# Altium schematic sheet 12V Regulator.SchDoc
size A
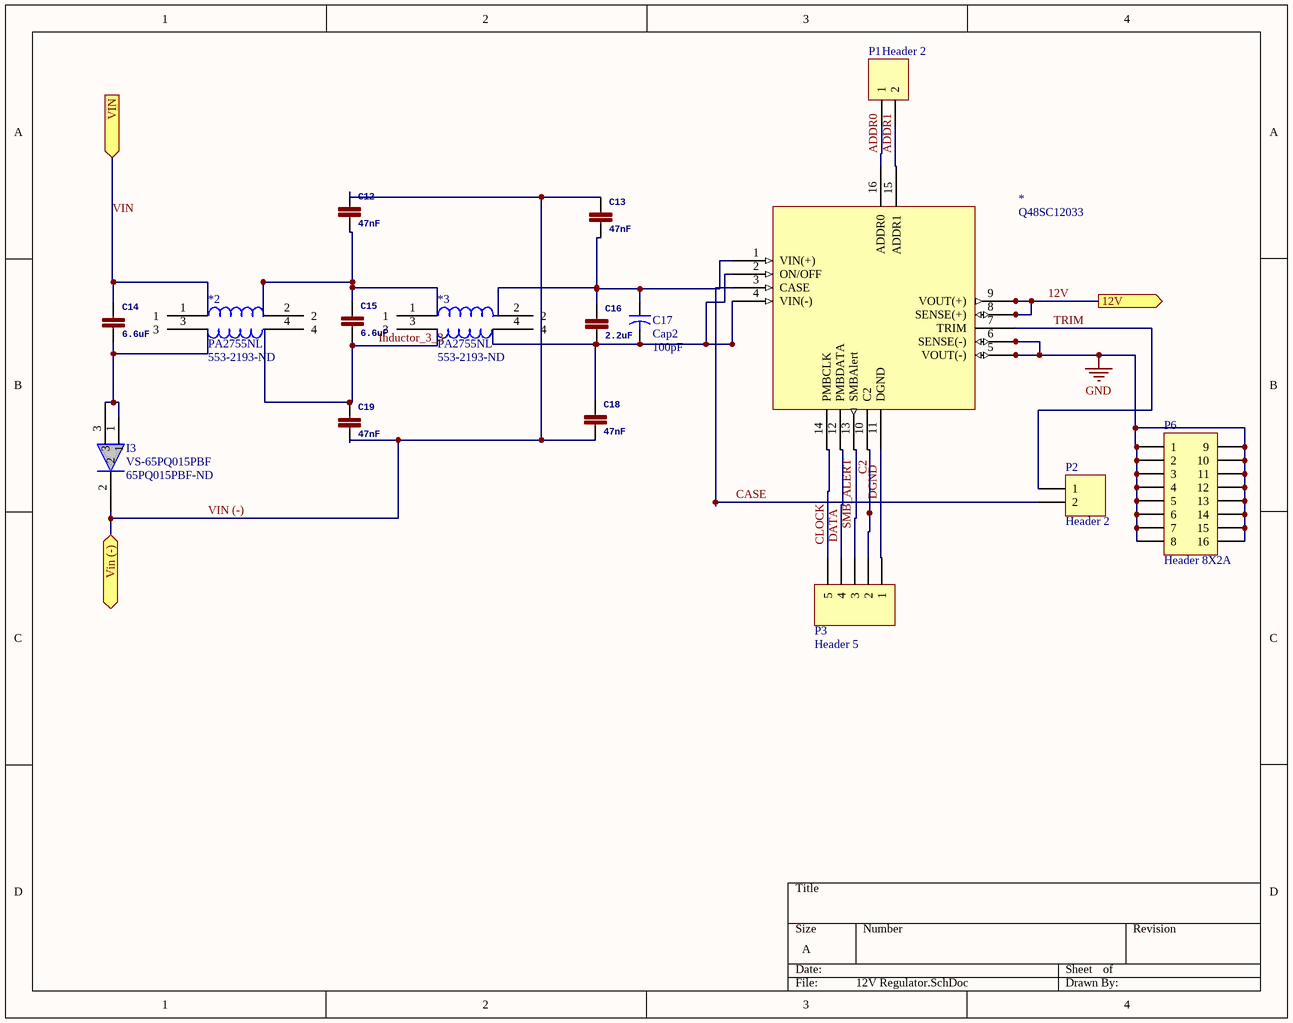
[diagram p0: 12V Regulator.SchDoc]

## Parts
*  Q48SC12033  [PCBComponent_1]
*2  PA2755NL  Supplier Part Number 1: 553-2193-ND  [Makeni]
*3  PA2755NL  Supplier Part Number 1: 553-2193-ND  [Makeni]
C12  47nF  [0402-CAP]
C13  47nF  [0402-CAP]
C14  6.6uF  [1206]
C15  6.6uF  [1206]
C16  2.2uF  [0603]
C17  Cap2  value 100pF  [CAPR5-4X5]
C18  47nF  [0402-CAP]
C19  47nF  [0402-CAP]
I3  VS-65PQ015PBF  Supplier Part Number 1: 65PQ015PBF-ND  [TO247AC]
P1  Header 2  [HDR1X2]
P2  Header 2  [HDR1X2]
P3  Header 5  [HDR1X5]
P6  Header 8X2A  [HDR2X8_CEN]

## Ports
12V (out), Vin (-), VIN (in)

## Nets
GND: *.5(VOUT(-)) *.6(SENSE(-)) P6.1 P6.2 P6.3 P6.4 P6.5 P6.6 P6.7 P6.8 P6.9 P6.10 P6.11 P6.12 P6.13 P6.14 P6.15 P6.16
12V: *.8(SENSE(+)) *.9(VOUT(+)) ; port 12V
ADDR0: *.16(ADDR0) P1.1
ADDR1: *.15(ADDR1) P1.2
CASE: *.3(CASE) P2.2
CLOCK: *.14(PMBCLK) P3.5
DATA: *.12(PMBDATA) P3.4
DGND: *.11(DGND) P3.1
Inductor_3_3: *2.4 *3.3 C15.2 C19.1
SMB_ALERT: *.13(SMBAlert) P3.3
TRIM: *.7(TRIM) P2.1
VIN: *2.1 C14.1 ; port VIN
VIN (-): C12.1 C13.1 C18.2 C19.2 I3.2 ; port Vin (-)
Net*2_2: *2.2 *3.1 C12.2 C15.1
Net*2_3: *2.3 C14.2 I3.1 I3.3
Net*_1: *.1(VIN(+)) *3.2 C13.2 C16.1 C17.1
Net*_2: *.2(ON/OFF) *.4(VIN(-)) *3.4 C16.2 C17.2 C18.1
Net*_10: *.10(C2) P3.2

## Notes on the sheet
- Labels drawn without touching a wire or pin: C2

## Library data of the parts
*2 *3 = PA2755NL: COMMON MODE CHOKE 14A 2LN SMD; Manufacturer: Pulse Electronics Power; Number of Lines: 2; DC Resistance (DCR) (Max): 1.95 mOhm; Supplier 1: Digi-Key; Manufacturer Part Number: PA2755NL; RoHS: RoHS Compliant; Category: Filters; Stock 1: 1352; Pricing 1: 1=3.45, 10=3.163, 100=2.07, 500=1.84, 1000=1.725, 2500=1.6675 (USD); Packaging: Tube; Part Status: Active; Filter Type: -; Current Rating (Max): 14A; Voltage Rating - DC: -; Voltage Rating - AC: -; Operating Temperature: -40°C ~ 130°C; Ratings: -; Approvals: -; Features: -; Mounting Type: Surface Mount; Size / Dimension: 0.750" L x 0.815" W (19.05mm x 20.70mm); Height (Max): 0.440" (11.18mm); Package / Case: Horizontal, 4 PC Pad; ComponentLink1URL: http://productfinder.pulseeng.com/products/datasheets/P688.pdf; ComponentLink1Description: http://productfinder.pulseeng.com/products/datasheets/P688.pdf
C12 C13 C18 C19 = 2.2UF-CERCAP-07888: PROD_ID: CAP-07888
C14 C15 = 2.2UF-CERCAP-10009: PROD_ID: CAP-10009
C16 = 1.5PF-0603-50V-16.667%: PROD_ID: CAP-08763
C17 = Cap2: Capacitor; Published: 23-Sep-2002; PackageReference: CAPR5-4X5; Publisher: Altium Limited; PackageDescription: Capacitor; 2 Leads
I3 = VS-65PQ015PBF: DIODE SCHOTTKY 15V 65A TO247AC; Manufacturer: Vishay Semiconductor Diodes Division; Speed: Fast Recovery =< 500ns, > 200mA (Io); Supplier 1: Digi-Key; Manufacturer Part Number: VS-65PQ015PBF; RoHS: RoHS Compliant; Category: Discrete Semiconductor Products; Stock 1: 478; Pricing 1: 1=4.17, 10=3.749, 25=3.5436, 100=3.0713, 250=2.91376, 500=2.6145, 1000=2.205 (USD); Packaging: Tube; Part Status: Active; Diode Type: Schottky; Current - Average Rectified (Io): 65A; Capacitance @ Vr, F: -; Mounting Type: Through Hole; Package / Case: TO-247-3; Supplier Device Package: TO-247AC; Operating Temperature - Junction: -55°C ~ 125°C; Base Part Number: *; ComponentLink1URL: http://www.vishay.com/docs/94246/vs-65pq015p.pdf; ComponentLink1Description: http://www.vishay.com/docs/94246/vs-65pq015p.pdf
P1 P2 = Header 2: Header, 2-Pin; LatestRevisionDate: 17-Jul-2002; LatestRevisionNote: Re-released for DXP Platform.; Publisher: Altium Limited
P3 = Header 5: Header, 5-Pin; LatestRevisionDate: 17-Jul-2002; LatestRevisionNote: Re-released for DXP Platform.; Publisher: Altium Limited
P6 = Header 8X2A: Header, 8-Pin, Dual row; LatestRevisionDate: 17-Jul-2002; LatestRevisionNote: Re-released for DXP Platform.; Publisher: Altium Limited